# EAGLE design usb_prototype (EAGLE 9.6.2)
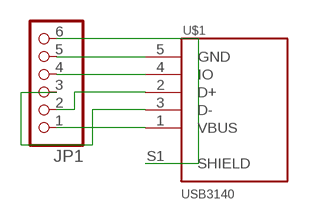
[diagram p0: schematic, sheet 1]

## Parts
JP1  PINHD-1X6  [1X06]
U$1  USB3140  [USB3140-30-0170-0-C]

## Nets
N$1: JP1.6 U$1.S1(SHIELD)
N$2: JP1.5 U$1.5(GND)
N$3: JP1.4 U$1.4(IO)
N$4: JP1.2 U$1.2(D+)
N$5: JP1.3 U$1.3(D-)
N$6: JP1.1 U$1.1(VBUS)

## Library data of the parts
JP1 = pinhead:PINHD-1X6: PIN HEADER
U$1 = USB:USB3140

## Board
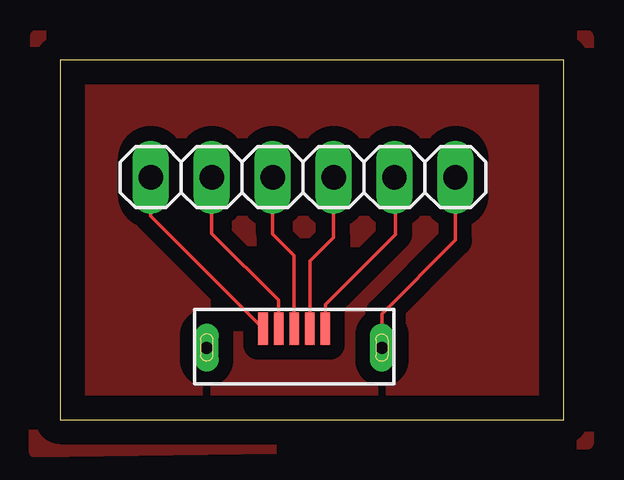
[diagram p1: board, top side]
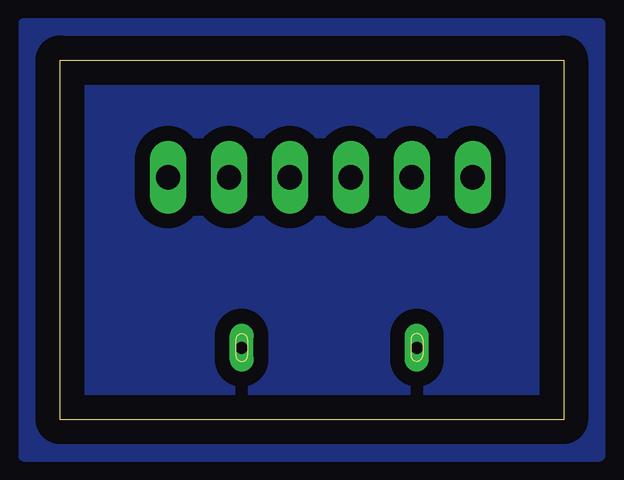
[diagram p2: board, bottom side, seen from below]

Size 21 x 15 mm. Coordinates in mm from the lower left corner, seen from the top.
Outline: 0,0 21,0 21,15 0,15 0,0
Copper layers (1*16): Top 0.035mm / dielectric 1.5mm / Bottom 0.035mm
Design rules "default": minimum track width 6mil, minimum drill 0.35mm, track to track 6mil, track to pad 6mil, pad to pad 6mil, via to via 6mil, smd to smd 6mil, copper to edge 40mil, drill to drill 6mil, minimum pad ring 10mil, minimum via ring 8mil, stop-mask expansion 4mil, vias tented up to drill 0mil, thermal gap 10mil

### Footprints (pad centres in the part's own frame; a part is rotated, then mirrored left to right if it is on the bottom)
1X06 = drill 1.016 long: 1 -6.35,0; 2 -3.81,0; 3 -1.27,0; 4 1.27,0; 5 3.81,0; 6 6.35,0
USB3140-30-0170-0-C = smd 0.4 x 1.35: 1 -1.3,0; 2 -0.65,0; 3 0,0; 4 0.65,0; 5 1.3,0 | drill 0.5 pad 0.775 long: S1 3.65,-0.8; S3 -3.65,-0.8

### Placement (x,y rotation side)
JP1  10.14,10.11 0 top
U$1  9.77,3.8 0 top

### Tracks (layer width: path | path; a pad name or v marks a point on that pad's centre or on a via)
GND
  pour Bottom (isolate 0.61): -1.5,16.5 22.5,16.5 22.5,-1.5 -1.5,-1.5
N$1
  Top 0.152: U$1.S1 13.42,4.41 16.49,7.48 JP1.6
N$2
  Top 0.152: U$1.5 11.07,4.8 13.99,7.72 13.99,10.07 JP1.5
N$3
  Top 0.152: U$1.4 10.42,6.61 11.41,7.6 JP1.4
N$4
  Top 0.152: U$1.2 9.12,4.98 6.33,7.77 JP1.2
N$5
  Top 0.152: U$1.3 9.77,6.84 8.87,7.74 JP1.3
N$6
  Top 0.152: U$1.1 3.79,8.48 JP1.1
TOPSIGNAL
  pour Top (isolate 0.61): -1,16 22,16 22,-1 -1.05,-1.35